# Altium schematic sheet Connectors.SchDoc: Connectors
size A4; DrawnBy: Flávio Silva; Engineer: Flávio Silva; Organization: CeNTI; Address1: Rua Fernando Mesquita 2785; Address2: Vila Nova de Famalicão; Address3: 4760-034, Portugal; Revision: 0; SheetNumber: 2; SheetTotal: 3; Project: AM2R- Safe2Wheels
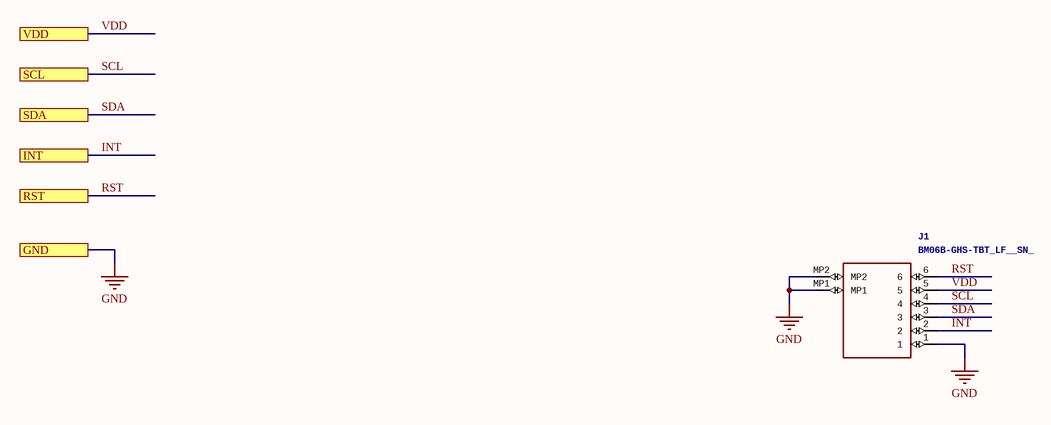
[diagram p0: Connectors.SchDoc]

## Parts
J1  BM06B-GHS-TBT_LF__SN_  [BM06BGHSTBTLFSN]

## Ports
GND, INT, RST, SCL, SDA, VDD

## Nets
GND: J1.1 J1.MP1 J1.MP2 ; port GND
INT: J1.2 ; port INT
RST: J1.6 ; port RST
SCL: J1.4 ; port SCL
SDA: J1.3 ; port SDA
VDD: J1.5 ; port VDD

## Notes on the sheet
- Title:
- Project:
- Date:
- Rev:
- Sheet
- of
- Author:

## Library data of the parts
J1 = BM06B-GHS-TBT_LF__SN_: BM06B Series 6 Position 1.25 mm Pitch Surface Mount Top Entry Shrouded Header   Source:  Datasheet; Manufacturer_Name: JST (JAPAN SOLDERLESS TERMINALS); Manufacturer_Part_Number: BM06B-GHS-TBT(LF)(SN); GateName_1: G$1; SymbolName_1: BM06B-GHS-TBT_LF__SN_; LibraryName: BM06B-GHS-TBT_LF__SN_; DeviceSetName: BM06B-GHS-TBT_LF__SN_; Height: 4.05mm